# Altium schematic sheet MIXER.SchDoc
size A3; DocumentNumber: 6; Revision: B; SheetNumber: 6; SheetTotal: 7; SheetTitle: Mixer; Designer: DM; Reviewer: -
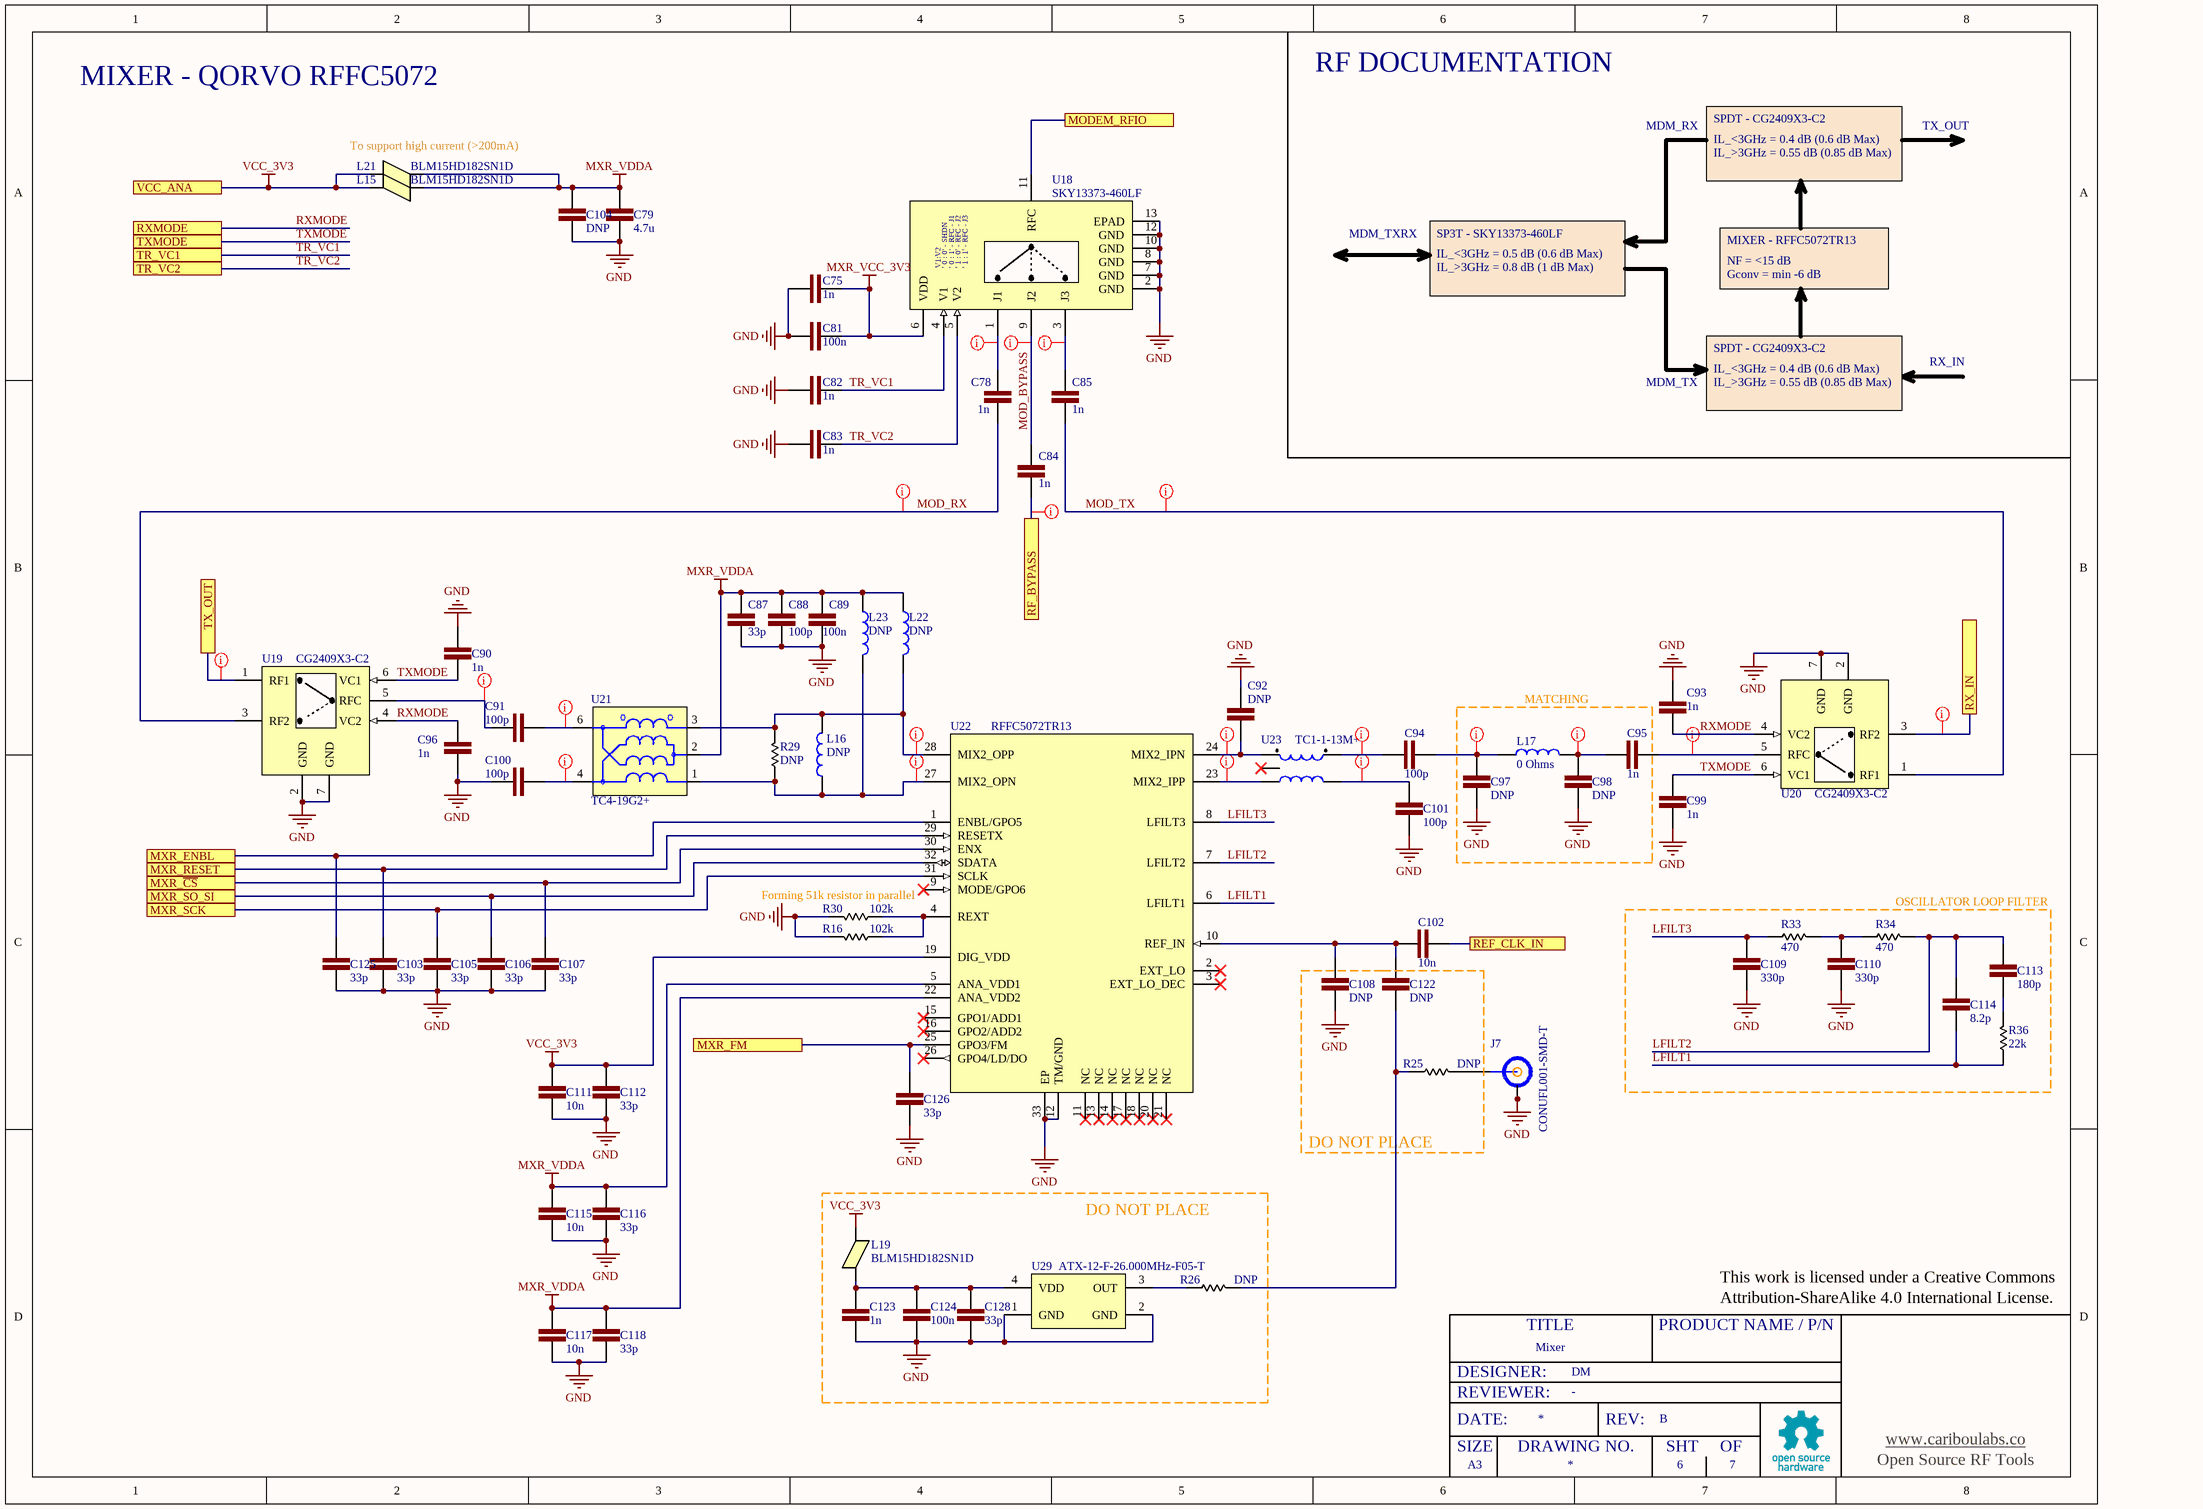
[diagram p0: MIXER.SchDoc]

## Parts
C75  1n  [MURATA 0402]
C78  1n  [MURATA 0402]
C79  4.7u  [MURATA 0402]
C81  100n  [MURATA 0402]
C82  1n  [MURATA 0402]
C83  1n  [MURATA 0402]
C84  1n  [MURATA 0402]
C85  1n  [MURATA 0402]
C87  33p  [MURATA 0402]
C88  100p  [MURATA 0402]
C89  100n  [MURATA 0402]
C90  1n  [MURATA 0402]
C91  100p  [MURATA 0402]
C92  DNP  [MURATA 0402]
C93  1n  [MURATA 0402]
C94  100p  [MURATA 0402]
C95  1n  [MURATA 0402]
C96  1n  [MURATA 0402]
C97  DNP  [MURATA 0402]
C98  DNP  [MURATA 0402]
C99  1n  [MURATA 0402]
C100  100p  [MURATA 0402]
C101  100p  [MURATA 0402]
C102  10n  [MURATA 0402]
C103  33p  [MURATA 0402]
C104  DNP  [MURATA 0402]
C105  33p  [MURATA 0402]
C106  33p  [MURATA 0402]
C107  33p  [MURATA 0402]
C108  DNP  [MURATA 0402]
C109  330p  [MURATA 0402]
C110  330p  [MURATA 0402]
C111  10n  [MURATA 0402]
C112  33p  [MURATA 0402]
C113  180p  [MURATA 0402]
C114  8.2p  [MURATA 0402]
C115  10n  [MURATA 0402]
C116  33p  [MURATA 0402]
C117  10n  [MURATA 0402]
C118  33p  [MURATA 0402]
C122  DNP  [MURATA 0402]
C123  1n  [MURATA 0402]
C124  100n  [MURATA 0402]
C125  33p  [MURATA 0402]
C126  33p  [MURATA 0402]
C128  33p  [MURATA 0402]
J7  CONUFL001-SMD-T  [LINX_CONUFL001-SMD-T]
L15  BLM15HD182SN1D  [0402 FERRITE BEAD]
L16  DNP  [CoilCraft 0402]
L17  0 Ohms  [CoilCraft 0402]
L19  BLM15HD182SN1D  [0402 FERRITE BEAD]
L21  BLM15HD182SN1D  [0402 FERRITE BEAD]
L22  DNP  [CoilCraft 0402]
L23  DNP  [CoilCraft 0402]
R16  102k  [PANASONIC 0402]
R25  DNP  [PANASONIC 0402]
R26  DNP  [PANASONIC 0402]
R29  DNP  [PANASONIC 0402]
R30  102k  [PANASONIC 0402]
R33  470  [PANASONIC 0402]
R34  470  [PANASONIC 0402]
R36  22k  [PANASONIC 0402]
U18  SKY13373-460LF  [QFN50P200X200X60-13N-D]
U19  CG2409X3-C2  [SON50P150X150X40-7N]
U20  CG2409X3-C2  [SON50P150X150X40-7N]
U21  TC4-19G2+  [TC4-19]
U22  RFFC5072TR13  [QFN50P500X500X85_HS-33N]
U23  TC1-1-13M+  [TC1-1-13M]
U29  ATX-12-F-26.000MHz-F05-T  [TCXO_4_25x20]

## Blocks framed on the sheet
MATCHING: C95 C97 C98 L17
OSCILLATOR LOOP FILTER: C109 C110 C113 C114 R33 R34 R36
DO NOT PLACE: C108 C122 R25
DO NOT PLACE: C123 C124 C128 L19 R26 U29

## Ports
MODEM_RFIO, MXR_ENBL, MXR_FM, MXR_RESET, MXR_SCK, MXR_SO_SI, MXR_~{CS}, REF_CLK_IN, RF_BYPASS, RX_IN, RXMODE, TR_VC1, TR_VC2, TX_OUT, TXMODE, VCC_ANA

## Nets
GND: C75.1 C79.2 C81.1 C82.2 C83.2 C87.1 C88.1 C89.1 C90.1 C92.1 C93.1 C96.1 C97.1 C98.1 C99.1 C100.2 C101.2 C103.2 C104.2 C105.2 C106.2 C107.2 C108.2 C109.2 C110.2 C111.2 C112.2 C115.2 C116.2 C117.2 C118.2 C123.1 C124.1 C125.2 C126.2 C128.1 J7.2(OUTER) J7.3(OUTER) R16.2 R30.2 U18.2(GND) U18.7(GND) U18.8(GND) U18.10(GND) U18.12(GND) U18.13(EPAD) U19.2(GND) U19.7(GND) U20.2(GND) U20.7(GND) U22.12(TM/GND) U22.33(EP) U29.1(GND) U29.2(GND)
MXR_VCC_3V3: C75.2 C81.2 U18.6(VDD)
MXR_VDDA: C79.1 C87.2 C88.2 C89.2 C104.1 C115.1 C116.1 C117.1 C118.1 L15.2 L21.2 L22.1 L23.1 U21.2(SCT) U22.5(ANA_VDD1) U22.22(ANA_VDD2)
VCC_3V3: C111.1 C112.1 L15.1 L19.2 L21.1 U22.19(DIG_VDD) ; port VCC_ANA
LFILT1: C114.2 R36.1 U22.6(LFILT1)
LFILT2: C113.1 C114.1 R34.2 U22.7(LFILT2)
LFILT3: C109.1 R33.1 U22.8(LFILT3)
MOD_BYPASS: C84.1 U18.9(J2)
MOD_RX: C78.2 U19.3(RF2)
MOD_TX: C85.2 U20.1(RF1)
MODEM_RFIO: U18.11(RFC) ; port MODEM_RFIO
MXR_~{CS}: C107.1 U22.30(ENX) ; port MXR_~{CS}
MXR_ENBL: C125.1 U22.1(ENBL/GPO5) ; port MXR_ENBL
MXR_FM: C126.1 U22.25(GPO3/FM) ; port MXR_FM
MXR_RESET: C103.1 U22.29(RESETX) ; port MXR_RESET
MXR_SCK: C105.1 U22.31(SCLK) ; port MXR_SCK
MXR_SO_SI: C106.1 U22.32(SDATA) ; port MXR_SO_SI
REF_CLK_IN: C102.1 ; port REF_CLK_IN
RF_BYPASS: C84.2 ; port RF_BYPASS
RX_IN: U20.3(RF2) ; port RX_IN
RXMODE: C93.2 C96.2 U19.4(VC2) U20.4(VC2) ; port RXMODE
TR_VC1: C82.1 U18.4(V1) ; port TR_VC1
TR_VC2: C83.1 U18.5(V2) ; port TR_VC2
TX_OUT: U19.1(RF1) ; port TX_OUT
TXMODE: C90.2 C99.2 U19.6(VC1) U20.6(VC1) ; port TXMODE
NetC78_1: C78.1 U18.1(J1)
NetC85_1: C85.1 U18.3(J3)
NetC91_1: C91.1 U19.5(RFC)
NetC91_2: C91.2 U21.6(PD)
NetC92_2: C92.2 U22.24(MIX2_IPN) U23.6
NetC94_1: C94.1 C97.2 L17.1
NetC94_2: C94.2 U23.1
NetC95_1: C95.1 U20.5(RFC)
NetC95_2: C95.2 C98.2 L17.2
NetC100_1: C100.1 U21.4(P)
NetC101_1: C101.1 U23.3
NetC102_2: C102.2 C108.1 C122.1 U22.10(REF_IN)
NetC110_1: C110.1 R33.2 R34.1
NetC113_2: C113.2 R36.2
NetC122_2: C122.2 R25.2 R26.1
NetC123_2: C123.2 C124.2 C128.2 L19.1 U29.4(VDD)
NetJ7_1: J7.1(INNER) R25.1
NetL16_1: L16.1 L23.2 R29.1 U21.1(S) U22.27(MIX2_OPN)
NetL16_2: L16.2 L22.2 R29.2 U21.3(SD) U22.28(MIX2_OPP)
NetR16_1: R16.1 R30.1 U22.4(REXT)
NetR26_2: R26.2 U29.3(OUT)
NetU22_23: U22.23(MIX2_IPP) U23.4

Not connected (* = marked no-connect by the designer): U22 2(EXT_LO)* 3(EXT_LO_DEC)* 9(MODE/GPO6)* 11(NC)* 13(NC)* 14(NC)* 15(GPO1/ADD1)* 16(GPO2/ADD2)* 17(NC)* 18(NC)* 20(NC)* 21(NC)* 26(GPO4/LD/DO)*; U23 2*

## Layout directives
net class RF50OHM: MOD_BYPASS, MOD_RX, MOD_TX, NetC78_1, NetC85_1, NetC91_1, NetC91_2, NetC92_2, NetC94_1, NetC94_2, NetC95_1, NetC95_2, NetC100_1, NetC101_1, NetL16_1, NetL16_2, NetU22_23, RF_BYPASS, RX_IN, TX_OUT

## Notes on the sheet
- MIXER - QORVO RFFC5072
- RF DOCUMENTATION
- To support high current (>200mA)
- MDM_RX
- SPDT - CG2409X3-C2
- IL_>3GHz = 0.55 dB (0.85 dB Max)
- IL_<3GHz = 0.4 dB (0.6 dB Max)
- TX_OUT
- MDM_TXRX
- SP3T - SKY13373-460LF
- MIXER - RFFC5072TR13
- IL_>3GHz = 0.8 dB (1 dB Max)
- IL_<3GHz = 0.5 dB (0.6 dB Max)
- Gconv = min -6 dB
- NF = <15 dB
- RX_IN
- MDM_TX
- (near U22) Forming 51k resistor in parallel
- This work is licensed under a Creative Commons
- Attribution-ShareAlike 4.0 International License.
- DESIGNER:
- REVIEWER:
- TITLE
- PRODUCT NAME / P/N
- SIZE
- DATE:
- DRAWING NO.
- REV:
- SHT
- OF
- www.cariboulabs.co
- A3
- Open Source RF Tools
- (in symbol SKY13373-460LF) V1:V2; ' 0 : 0' - SHDN; ' 0 : 1' - RFC - J1; ' 1 : 0' - RFC - J2; ' 1 : 1' - RFC - J3

## Library data of the parts
C75 C78 C82-C85 C90 C93 C95 C96 C99 C123 = Capacitor: Multilayer Ceramic Capacitors MLCC 1000pF ±5% 100V C0G 0402; Manu. P/N: GRM1555C2A102JE01D; Temp. Range: [-40, 125]; SRF: TBD [GHz]; Initial Voltage: 0; Tolerance: 5%; Vmax: 100V; Technology: C0G; VALUE: 1n
C79 = Capacitor: Multilayer Ceramic Capacitors MLCC - SMD/SMT 0402 MLCC X5R 4.7 uF +/ -20% 10V; Tolerance: 20%; Manu. P/N: GRJ155R61A475ME11J; Temp. Range: [-55, 85]; SRF: TBD [GHz]; Initial Voltage: 0; Vmax: 10V; Technology: X5R; VALUE: 4.7u
C81 C89 C124 = Capacitor: Multilayer Ceramic Capacitors MLCC - SMD/SMT 16V .1uF X5R 0402 10%; Manu. P/N: 0402YD104KAT2A; Temp. Range: [-55, 85]; SRF: TBD [GHz]; Initial Voltage: 0; Tolerance: 10%; Vmax: 16V; Technology: X5R; VALUE: 100n
C87 C103 C105-C107 C112 C116 C118 C125 C126 C128 = Capacitor: Multilayer Ceramic Capacitors MLCC - SMD/SMT 0402 50V 33pF C0G 0402 5%; Manu. P/N: C0402C330J5GAC; Temp. Range: [-55, 125]; SRF: TBD [GHz]; Initial Voltage: 0; Tolerance: 5%; Vmax: 50V; Technology: C0G; VALUE: 33p
C88 C91 C94 C100 C101 = Capacitor: Multilayer Ceramic Capacitors MLCC - SMD/SMT 50V 100pF +/-0.05; Tolerance: 0.05pF; Manu. P/N: C0402C101J5GACTU; Temp. Range: [-55, 125]; SRF: TBD [GHz]; Initial Voltage: 0; Vmax: 50V; Technology: C0G; VALUE: 100p
C92 C97 C98 = Capacitor: Tolerance: 5%; Vmax: 10V; Temp. Range: [-40, 125]; SRF: TBD [GHz]; Initial Voltage: 0; Manu. P/N: *; Technology: C0G; VALUE: DNP
C102 C108 C111 C115 C117 = Capacitor: Multilayer Ceramic Capacitors MLCC - SMD/SMT 0402, 0.01UF 25V C0G; Tolerance: 5%; Manu. P/N: GRM1555C1E103JE01J; Temp. Range: [-55, 125]; SRF: TBD [GHz]; Initial Voltage: 0; Vmax: 25V; Technology: C0G
  C102 C111 C115 C117: VALUE: 10n
  C108: VALUE: DNP
C104 = Capacitor: Multilayer Ceramic Capacitors MLCC - SMD/SMT 0402 MLCC X5R 4.7 uF +/ -20% 10V; Tolerance: 20%; Temp. Range: [-55, 85]; SRF: TBD [GHz]; Initial Voltage: 0; Vmax: 10V; Manu. P/N: DNP; Technology: X5R; VALUE: DNP
C109 C110 = Capacitor: Multilayer Ceramic Capacitors MLCC - SMD/SMT 0402 330pF 50volts C0G 5%; Vmax: 50V; Manu. P/N: GRM1555C1H331JA01D; Temp. Range: [-55, 125]; SRF: TBD [GHz]; Initial Voltage: 0; Tolerance: 5%; Technology: C0G; VALUE: 330p
C113 = Capacitor: Multilayer Ceramic Capacitors MLCC - SMD/SMT 180pF 50V 1% 0402 NPO; Manu. P/N: 0402N181F500CT; Temp. Range: [-55, 125]; SRF: TBD [GHz]; Initial Voltage: 0; Tolerance: 1%; Vmax: 50V; Technology: C0G; VALUE: 180p
C114 = Capacitor: Multilayer Ceramic Capacitors MLCC - SMD/SMT 50V 8.2pF C0G 0402 .1pF Tol; Tolerance: 0.1p; Manu. P/N: 04025A8R2BAT2A; Temp. Range: [-55, 125]; SRF: TBD [GHz]; Initial Voltage: 0; Vmax: 50V; Technology: C0G; VALUE: 8.2p
C122 = Capacitor: Multilayer Ceramic Capacitors MLCC - SMD/SMT 0402, 0.01UF 25V C0G; Tolerance: 5%; Temp. Range: [-55, 125]; SRF: TBD [GHz]; Initial Voltage: 0; Vmax: 25V; Manu. P/N: DNP; Technology: C0G; VALUE: DNP
J7 = CONUFL001-SMD-T: RF Connectors / Coaxial Connectors U.FL Straight Surface Mount Jack; Manu. P/N: CONUFL001-SMD-T
L15 L19 L21 = BLM15: Ferrite Beads 1800ohms GHz HiSpd; Imax: 0.2 A; Max DC Resistance: 2.2 Ohms; Temp. Range: [-40, 125]; Tolerance: 25%; Impedance @ 100 MHz: 1800 Ohms; Manu. P/N: BLM15HD182SN1D
L16 L22 L23 = Inductor: Tolerance: 5%; DC Imax: TBD [A]; DC Rmax: TBD [Ohm]; SRF: TBD [GHz]; Manu. P/N: *; VALUE: DNP
L17 = Inductor: 0 Ohms jumper resistor 0402; Tolerance: 5%; Manu. P/N: CRCW04020000Z0EDC; DC Imax: TBD [A]; DC Rmax: TBD [Ohm]; SRF: TBD [GHz]; VALUE: 0 Ohms
R16 R30 = Resistor: Thick Film Resistors - SMD 102 kOhms 62.5mW 0402 1%; Manu. P/N: RC0402FR-07102KL; Power Rating: 62.5 mW (1/16 W); Temp. Ceoff.: 100 PPM / C; Tolerance: 1%; VALUE: 102k
R25 R26 = Resistor: Power Rating: 62.5 mW (1/16 W); Temp. Ceoff.: 100 PPM / C; Tolerance: 1%; Manu. P/N: DNP; VALUE: DNP
R29 = Resistor: Power Rating: 100 mW; Temp. Ceoff.: 0 PPM/C; Tolerance: 1%; Manu. P/N: *; VALUE: DNP
R33 R34 = Resistor: Thick Film Resistors - SMD 1/16watt 470ohms 1%; Manu. P/N: CRCW0402470RFKED; Power Rating: 62.5 mW (1/16 W); Temp. Ceoff.: 100 PPM / C; Tolerance: 1%; VALUE: 470
R36 = Resistor: Thick Film Resistors - SMD 1/16watt 22kohms 1%; Manu. P/N: CRCW040222K0FKEDC; Power Rating: 62.5 mW (1/16 W); Temp. Ceoff.: 100 PPM / C; Tolerance: 1%; VALUE: 22k
U18 = SKY13373-460LF: RF Switch ICs .1-6.0GHz SP3T IL .45dB @ 2.5GHz; Manu. P/N: SKY13373-460LF
U19 U20 = CG2409X3-C2: RF Switch ICs 50-6000MHz SPDT 802.11a/b/g/n/ac; Manu. P/N: CG2409X3-C2
U21 = TC4-19G2+: Audio Transformers / Signal Transformers TC XFMR / SURF MOUNT / RoHS, Alternatives - TC4-19+; Manu. P/N: TC4-19G2+
U22 = RFFC5072TR13: RF Mixer LO Freq. 85-4200MHz WB Synthesizer/VCO; Manu. P/N: RFFC5072TR13
U23 = TC1-1-13M: Transformers / Signal Transformers TC XFMR / SURF MOUNT; Alt. Manu. P/N: RFXF9503; Manu. P/N: TC1-1-13M+
U29 = ATX-12-F-26.000MHz-F05-T: TCXO Oscillators XTAL OSC TCXO 26 MHz Clipped Sinewave 0.5ppm -40C +85C 2.5x2mm, 1.6-3.6V; Value: 26 MHz; Manu. P/N: ATX-12-F-26.000MHz-F05-T